# EAGLE schematic node (EAGLE 9.3.0)
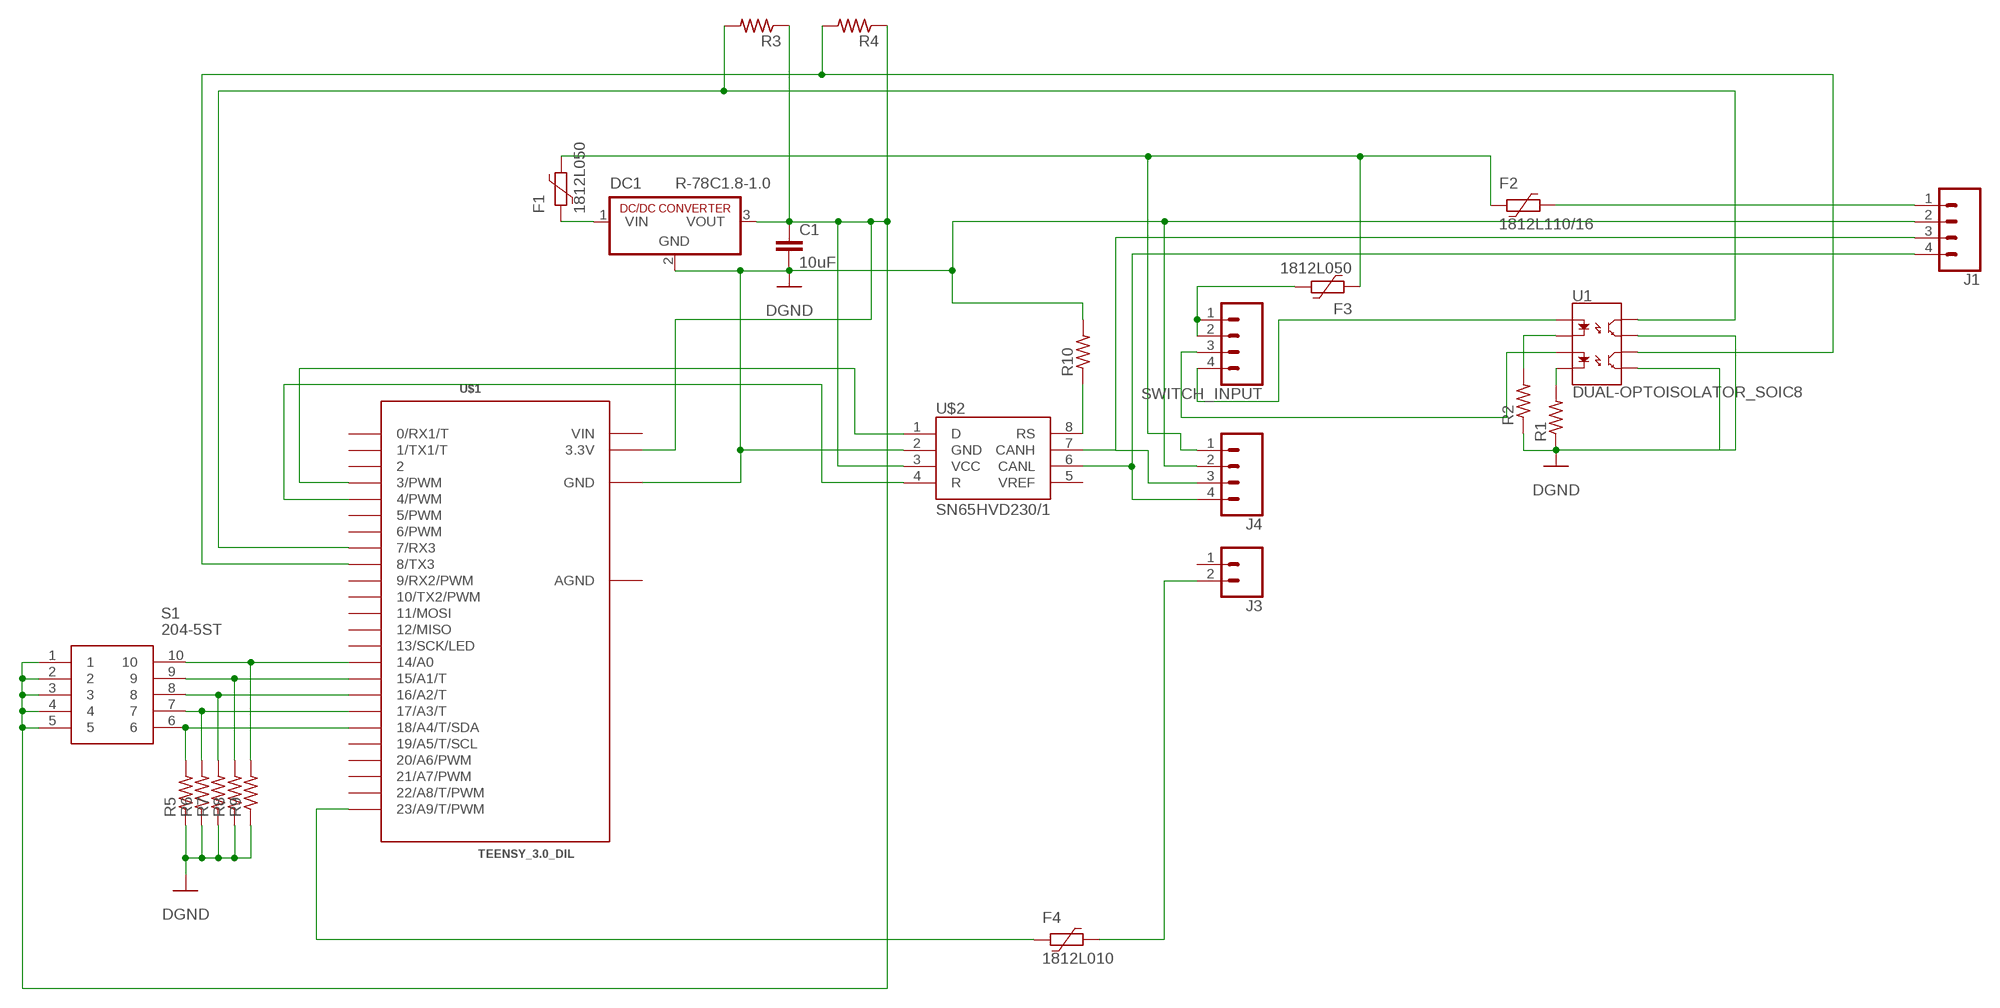
[diagram p0: schematic, sheet 1]

## Parts
C1  10uF  10UF-1206-6.3V-20%  [1206]
DC1  R-78C1.8-1.0  [SIP3]
F1  1812L050  [1812L]
F2  1812L110/16  [1812L]
F3  1812L050  [1812L]
F4  1812L010  [1812L]
J1  CONN_04POLAR  [MOLEX-1X4]
J3  CONN_02POLAR  [MOLEX-1X2]
J4  CONN_04POLAR  [MOLEX-1X4]
R1  R-US_R1206  [R1206]
R2  R-US_R1206  [R1206]
R3  R-US_R1206  [R1206]
R4  R-US_R1206  [R1206]
R5  R-US_R1206  [R1206]
R6  R-US_R1206  [R1206]
R7  R-US_R1206  [R1206]
R8  R-US_R1206  [R1206]
R9  R-US_R1206  [R1206]
R10  R-US_R1206  [R1206]
S1  204-5ST  [SOP254P1152X760-10N]
SWITCH_INPUT  CONN_04POLAR  [MOLEX-1X4]
U1  DUAL-OPTOISOLATOR_SOIC8  [SO08]
U$1  TEENSY_3.0_DIL  [TEENSY_3.0-3.2&LC_DIL]
U$2  SN65HVD230/1  [SO8]

## Nets
GND: C1.2 DC1.2(GND) J1.2 J4.2 R1.1 R2.1 R5.1 R6.1 R7.1 R8.1 R9.1 R10.2 U1.5(EM2) U1.7(EM1) U$1.GND U$2.2(GND) ; supply symbol labelled DGND
N$1: U$1.3(3/PWM) U$2.1(D)
N$2: U$1.4(4/PWM) U$2.4(R)
N$3: C1.1 DC1.3(VOUT) R3.1 R4.1 S1.1 S1.2 S1.3 S1.4 S1.5 U$1.3.3V U$2.3(VCC)
N$4: SWITCH_INPUT.3 U1.3(A2)
N$5: SWITCH_INPUT.4 U1.1(A1)
N$6: F4.1 J3.2
N$7: J1.3 J4.3 U$2.7(CANH)
N$8: J1.4 J4.4 U$2.6(CANL)
N$9: R9.2 S1.10 U$1.14/A0
N$10: R1.2 U1.4(C2)
N$11: R2.2 U1.2(C1)
N$12: R3.2 U1.8(CL1) U$1.7(7/RX3)
N$13: R4.2 U1.6(CL2) U$1.8(8/TX3)
N$14: F1.1 F2.2 F3.2 J4.1
N$15: F2.1 J1.1
N$16: F3.1 SWITCH_INPUT.1 SWITCH_INPUT.2
N$17: R8.2 S1.9 U$1.15/A1(15/A1/T)
N$18: R7.2 S1.8 U$1.16/A2(16/A2/T)
N$19: R6.2 S1.7 U$1.17/A3(17/A3/T)
N$20: R5.2 S1.6 U$1.18/A4(18/A4/T/SDA)
N$21: F4.2 U$1.23/A9(23/A9/T/PWM)
N$22: DC1.1(VIN) F1.2
N$23: R10.1 U$2.8(RS)
Unconnected: J3.1 U$1.0(0/RX1/T) U$1.1(1/TX1/T) U$1.2 U$1.5(5/PWM) U$1.6(6/PWM) U$1.9(9/RX2/PWM) U$1.10(10/TX2/PWM) U$1.11(11/MOSI) U$1.12(12/MISO) U$1.13(13/SCK/LED) U$1.19/A5(19/A5/T/SCL) U$1.20/A6(20/A6/PWM) U$1.21/A7(21/A7/PWM) U$1.22/A8(22/A8/T/PWM) U$2.5(VREF)

## Power pins joined to a net without a drawn wire
AGND: U$1.AGND
VIN: U$1.VIN

## Library data of the parts
C1 = SparkFun-Capacitors:10UF: 10.0µF ceramic capacitors A capacitor is a passive two-terminal electrical component used to store electrical energy temporarily in an electric field.; PROD_ID: CAP-10057
DC1 = dc-dc-converter:R-78C*-1.0: INNOLINE DC/DC-Converter 1.0 AMP SIP3 Single Output Source: Data sheet <http://www.mikrocontroller.net/attachment/150645/157764-da-01-en-DC_DC_WANDLER_R_78C5_0_1_0.pdf>
F1 F3 = polyfuse-smd_10:?: Polyfuse Resettable PTC Source: http://www.littelfuse.com/products/resettable-ptcs.aspx; MF: Littelfuse; MPN: 1812L050; OC_FARNELL: 1653478; OC_NEWARK: 18M4786
F2 = polyfuse-smd_10:?: Polyfuse Resettable PTC Source: http://www.littelfuse.com/products/resettable-ptcs.aspx; MF: Littelfuse; MPN: 1812L110/16; OC_FARNELL: 1597004; OC_NEWARK: 05M2402
F4 = polyfuse-smd_10:?: Polyfuse Resettable PTC Source: http://www.littelfuse.com/products/resettable-ptcs.aspx; MF: Littelfuse; MPN: 1812L010; OC_FARNELL: 1822210; OC_NEWARK: 78R5551
J1 J4 SWITCH_INPUT = SparkFun-Connectors:CONN_04: Multi connection point. Often used as Generic Header-pin footprint for 0.1 inch spaced/style header connections On any of the 0.1 inch spaced packages, you can populate with these: Break Away Headers - Straight <https://www.sparkfun.com/products/116> (PRT-00116) Break Away Male Headers - Right Angle <https://www.sparkfun.com/products/553> (PRT-00553) Female Headers <https://www.sparkfun.com/products/115> (PRT-00115) Break Away Headers - Machine Pin <https://www.sparkfun.com/products/117> (PRT-00117) Break Away Female Headers - Swiss Machine Pin <https://www.sparkfun.com/products/743> (PRT-00743) For SCREWTERMINALS and SPRING TERMINALS visit here: Screw Terimnals on SparkFun.com <https://www.sparkfun.com/search/results?term=Screw+Terminals> (5mm/3.5mm/2.54mm spacing) This device is also useful as a general connection point to wire up your design to another part of your project. Our various solder wires solder well into these plated through hole pads. Hook-Up Wire - Assortment (Stranded, 22 AWG) <https://www.sparkfun.com/products/11375> (PRT-11375) Hook-Up Wire - Assortment (Solid Core, 22 AWG) <https://www.sparkfun.com/products/11367> (PRT-11367) View the entire wire category on our website here <https://www.sparkfun.com/categories/141> Special notes: Molex polarized connector foot print use with SKU : PRT-08231 with associated crimp pins and housings. 1MM SMD Version SKU: PRT-10208; PROD_ID: CONN-08186; SF_ID: PRT-08231
J3 = SparkFun-Connectors:CONN_02: Multi connection point. Often used as Generic Header-pin footprint for 0.1 inch spaced/style header connections On any of the 0.1 inch spaced packages, you can populate with these: Break Away Headers - Straight <https://www.sparkfun.com/products/116> (PRT-00116) Break Away Male Headers - Right Angle <https://www.sparkfun.com/products/553> (PRT-00553) Female Headers <https://www.sparkfun.com/products/115> (PRT-00115) Break Away Headers - Machine Pin <https://www.sparkfun.com/products/117> (PRT-00117) Break Away Female Headers - Swiss Machine Pin <https://www.sparkfun.com/products/743> (PRT-00743) For SCREWTERMINALS and SPRING TERMINALS visit here: Screw Terimnals on SparkFun.com <https://www.sparkfun.com/search/results?term=Screw+Terminals> (5mm/3.5mm/2.54mm spacing) This device is also useful as a general connection point to wire up your design to another part of your project. Our various solder wires solder well into these plated through hole pads. Hook-Up Wire - Assortment (Stranded, 22 AWG) <https://www.sparkfun.com/products/11375> (PRT-11375) Hook-Up Wire - Assortment (Solid Core, 22 AWG) <https://www.sparkfun.com/products/11367> (PRT-11367) View the entire wire category on our website here <https://www.sparkfun.com/categories/141> Special notes: Molex polarized connector foot print use with: PRT-08233 with associated crimp pins and housings. 2.54_SCREWTERM for use with PRT-10571. 3.5mm Screw Terminal footprints for PRT-08084 5mm Screw Terminal footprints for use with PRT-08432; SF_ID: PRT-09918
R1-R10 = rcl:R-US_: RESISTOR, American symbol; SPICEPREFIX: R
S1 = 204-5ST:204-5ST: DIP Switches / SIP Switches SPST 5 switch sections Source: Datasheet <https://eagle.componentsearchengine.com/Datasheets/1/204-5ST.pdf>; DESCRIPTION: DIP Switches / SIP Switches SPST 5 switch sections; HEIGHT: 7.6mm; MANUFACTURER_NAME: CTS; MANUFACTURER_PART_NUMBER: 204-5ST
U1 = SparkFun-DiscreteSemi:DUAL-OPTOISOLATOR: Optocoupler, Phototransistor Output, Dual Channel Optically coupled pairs with a gallium arsenide infrared LED and a silicon NPN phototransistor. Signal information, including a DC level, can be transmitted by the device while maintaining a high degree of electrical isolation between input and output. Datasheet <https://www.sparkfun.com/datasheets/Components/SMD/ild205t.pdf> SparkFun Products: SparkFun Opto-isolator Breakout <https://www.sparkfun.com/products/9118>; PROD_ID: IC-09076
U$1 = Teensy_3_and_LC_Series_Boards_v1.4:TEENSY_3.0_DIL: TEENSY 3.0 in a classic breadboard layout - pins between the two outer rows.
U$2 = texas_instruments:SN65HVD230/1